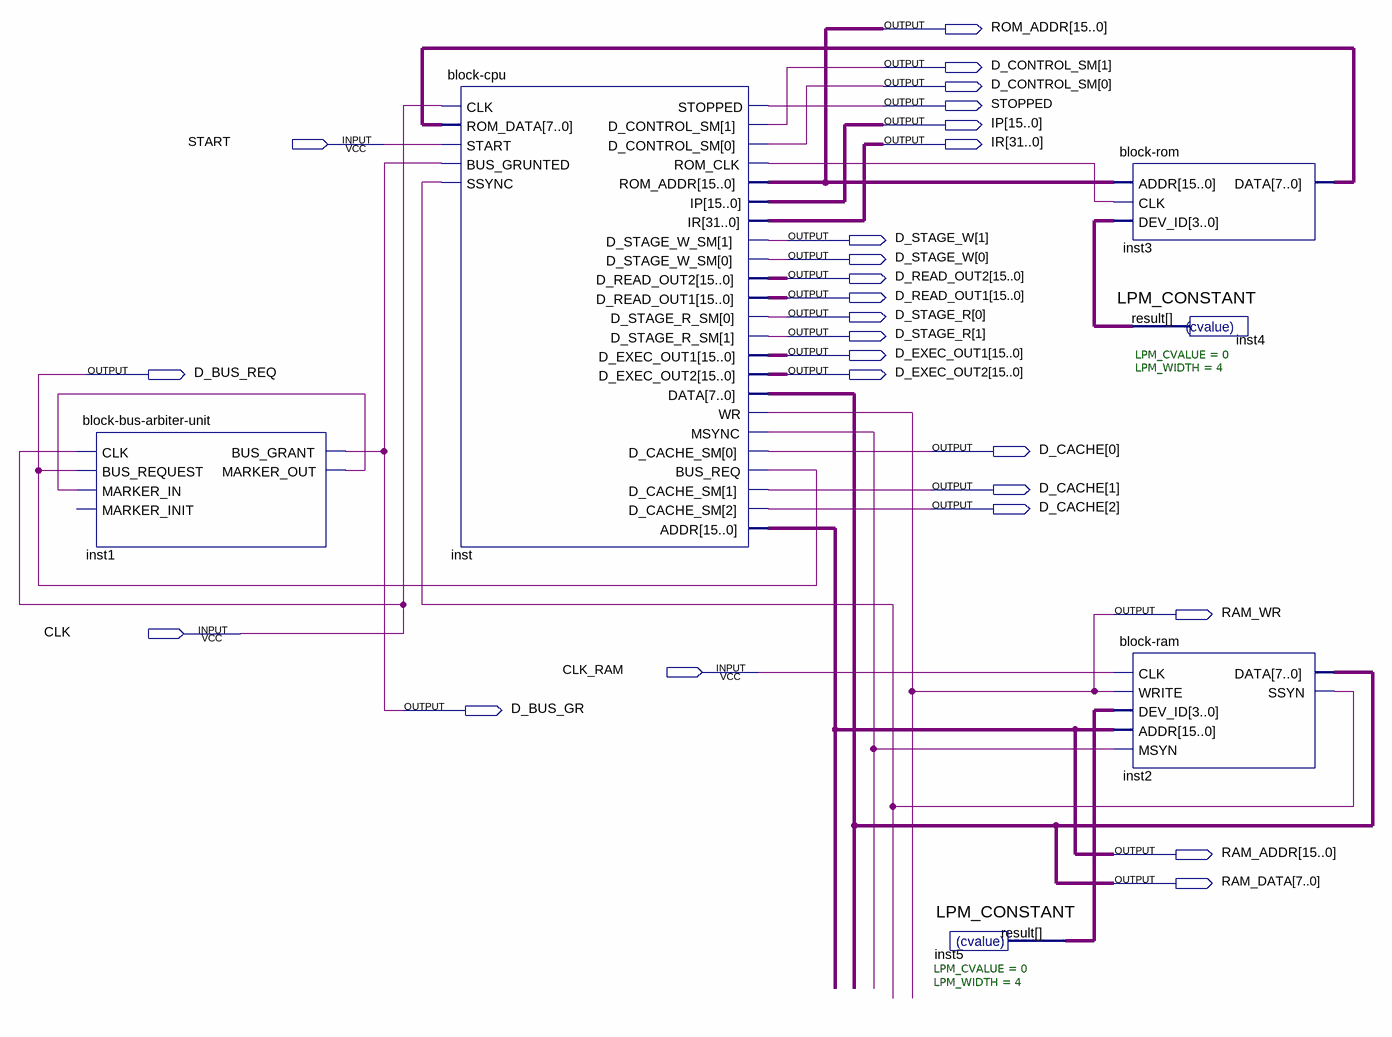
[diagram p0: schematic sheet]
// Quartus schematic microcontroller.bdf as structural Verilog: 6 symbols, 25 pins
module microcontroller (
  input  START,
  input  CLK,
  input  CLK_RAM,
  output [15:0] ROM_ADDR,
  output [1:0] D_CONTROL_SM,
  output STOPPED,
  output [15:0] IP,
  output [31:0] IR,
  output [1:0] D_STAGE_W,
  output [15:0] D_READ_OUT2,
  output [15:0] D_READ_OUT1,
  output [1:0] D_STAGE_R,
  output [15:0] D_EXEC_OUT1,
  output D_BUS_REQ,
  output [15:0] D_EXEC_OUT2,
  output [2:0] D_CACHE,
  output RAM_WR,
  output D_BUS_GR,
  output [15:0] RAM_ADDR,
  output [7:0] RAM_DATA
);

  wire inst1_marker_out, inst2_ssyn, inst_msync, inst_rom_clk;
  wire [3:0] inst4_result, inst5_result;
  wire [7:0] inst3_data;

  \block-bus-arbiter-unit  inst1 (
    .CLK(CLK), .BUS_REQUEST(D_BUS_REQ), .MARKER_IN(inst1_marker_out), .BUS_GRANT(D_BUS_GR),
    .MARKER_OUT(inst1_marker_out));  // open: MARKER_INIT
  \block-cpu  inst (
    .CLK(CLK), .ROM_DATA(inst3_data), .START(START), .BUS_GRUNTED(D_BUS_GR), .SSYNC(inst2_ssyn),
    .STOPPED(STOPPED), .D_CONTROL_SM(D_CONTROL_SM), .ROM_CLK(inst_rom_clk), .ROM_ADDR(ROM_ADDR), .IP(IP),
    .IR(IR), .D_STAGE_W_SM(D_STAGE_W), .D_READ_OUT2(D_READ_OUT2), .D_READ_OUT1(D_READ_OUT1),
    .D_STAGE_R_SM(D_STAGE_R), .D_EXEC_OUT1(D_EXEC_OUT1), .D_EXEC_OUT2(D_EXEC_OUT2), .WR(RAM_WR),
    .MSYNC(inst_msync), .D_CACHE_SM(D_CACHE), .BUS_REQ(D_BUS_REQ), .ADDR(RAM_ADDR), .DATA(RAM_DATA));
  LPM_CONSTANT #(.LPM_CVALUE(0), .LPM_WIDTH(4)) inst5 (.result(inst5_result));
  \block-rom  inst3 (.ADDR(ROM_ADDR), .CLK(inst_rom_clk), .DEV_ID(inst4_result), .DATA(inst3_data));
  LPM_CONSTANT #(.LPM_CVALUE(0), .LPM_WIDTH(4)) inst4 (.result(inst4_result));
  \block-ram  inst2 (
    .CLK(CLK_RAM), .WRITE(RAM_WR), .DEV_ID(inst5_result), .ADDR(RAM_ADDR), .MSYN(inst_msync),
    .SSYN(inst2_ssyn), .DATA(RAM_DATA));
endmodule
